# EAGLE design slave (EAGLE 5.11)
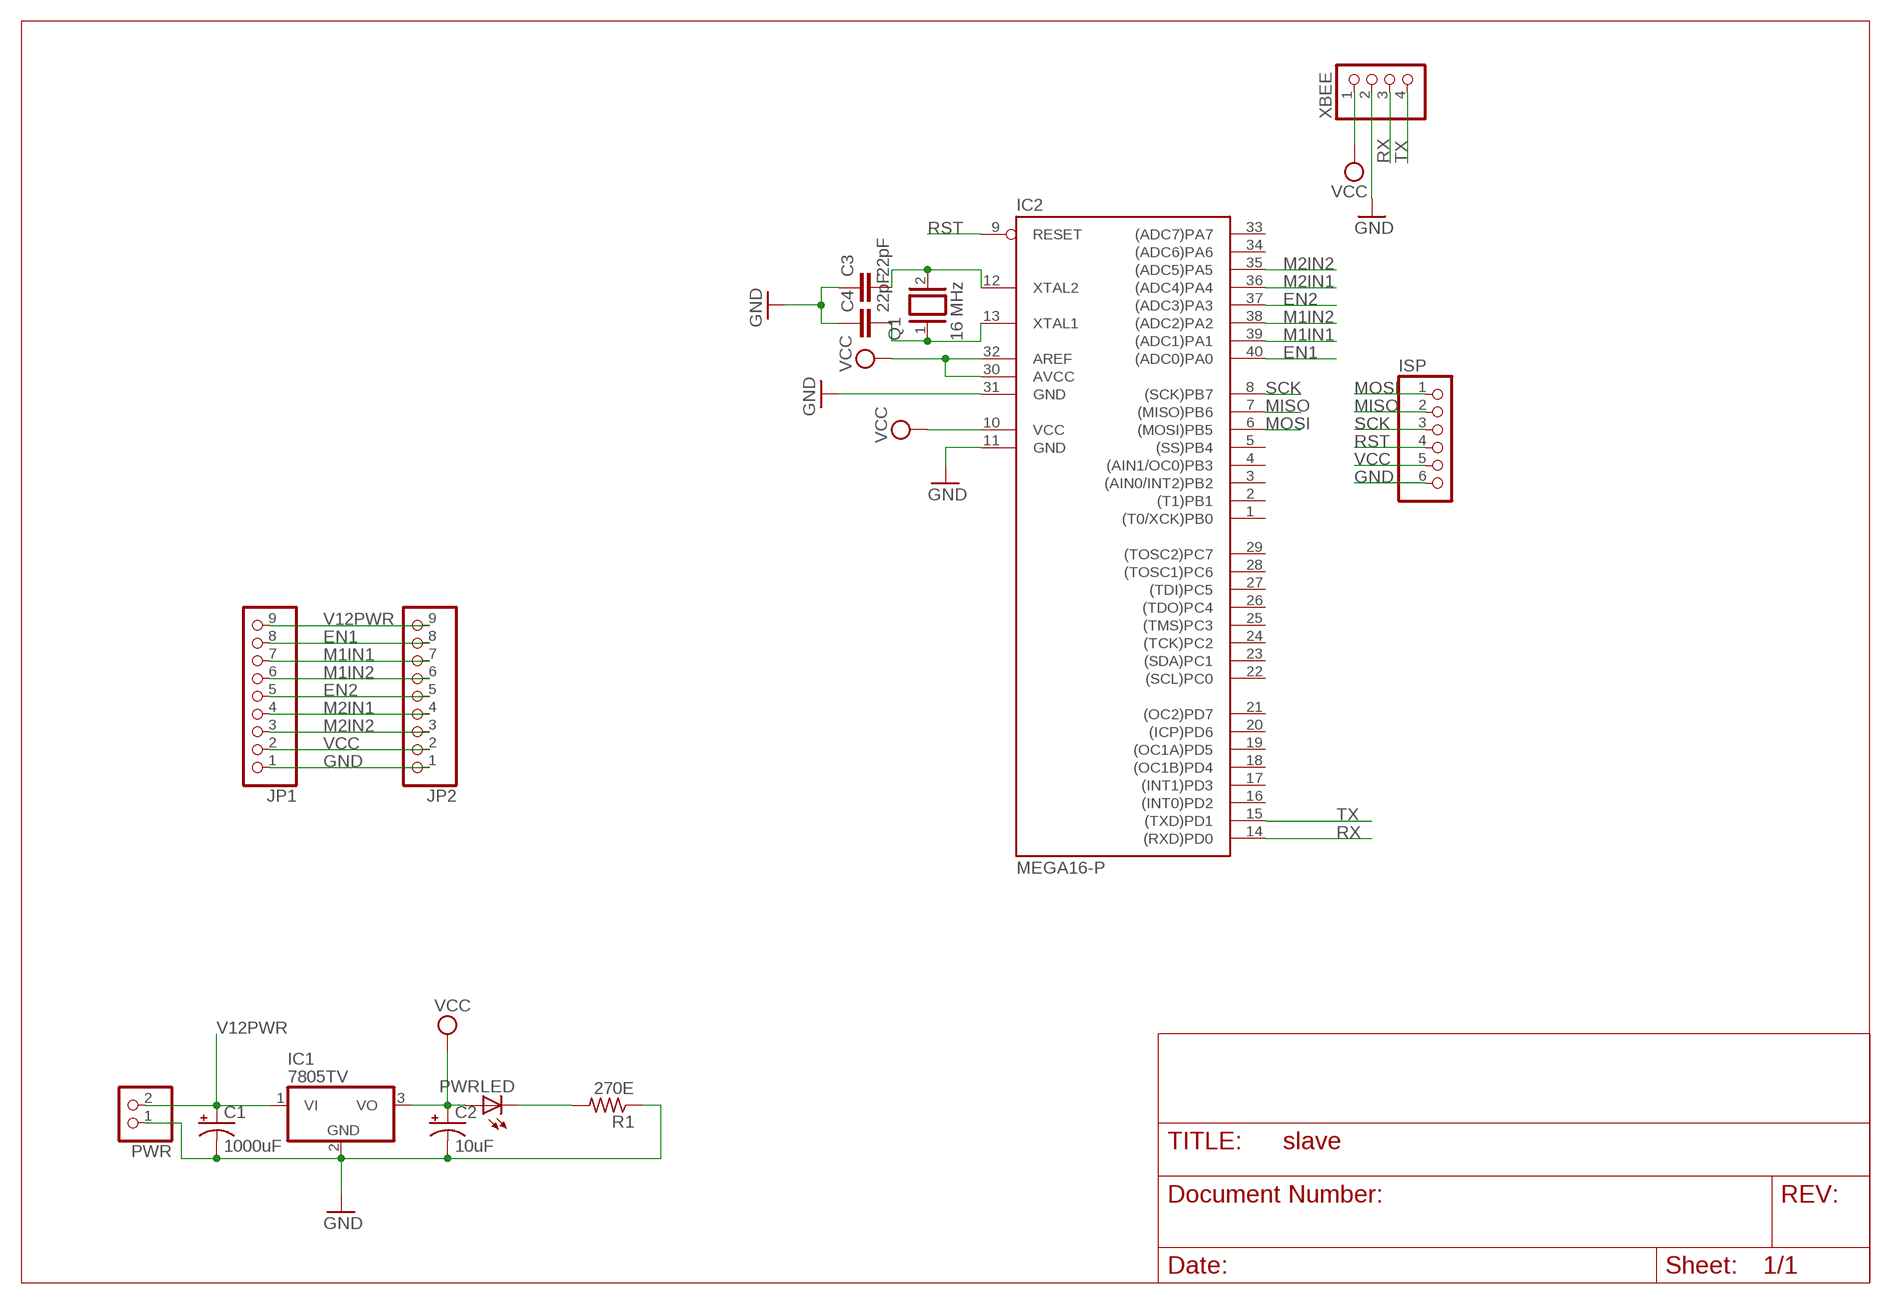
[diagram p0: schematic, sheet 1]

## Parts
C1  1000uF  CPOL-USE3.5-8  [E3,5-8]
C2  10uF  CPOL-USE2.5-6  [E2,5-6]
C3  22pF  C2,5-3  [C2.5-3]
C4  22pF  C2,5-3  [C2.5-3]
IC1  7805TV  [TO220V]
IC2  MEGA16-P  [DIL40]
ISP  PINHD-1X6  [1X06]
JP1  PINHD-1X9  [1X09]
JP2  PINHD-1X9  [1X09]
PWR  PINHD-1X2  [1X02]
PWRLED  LED5MM  [LED5MM]
Q1  16 MHz  XTAL/S  [QS]
R1  270E  R-US_0207/7  [0207/7]
XBEE  PINHD-1X4  [1X04]

## Nets
EN1: IC2.40((ADC0)PA0) JP1.8 JP2.8
EN2: IC2.37((ADC3)PA3) JP1.5 JP2.5
GND: C1.- C2.- C3.1 C4.1 IC1.2(GND) IC2.11(GND) IC2.31(GND) ISP.6 JP1.1 JP2.1 PWR.1 R1.1 XBEE.2
M1IN1: IC2.39((ADC1)PA1) JP1.7 JP2.7
M1IN2: IC2.38((ADC2)PA2) JP1.6 JP2.6
M2IN1: IC2.36((ADC4)PA4) JP1.4 JP2.4
M2IN2: IC2.35((ADC5)PA5) JP1.3 JP2.3
MISO: IC2.7((MISO)PB6) ISP.2
MOSI: IC2.6((MOSI)PB5) ISP.1
N$2: C3.2 IC2.12(XTAL2) Q1.2
N$3: PWRLED.K(C) R1.2
N$4: C4.2 IC2.13(XTAL1) Q1.1
RST: IC2.9(RESET) ISP.4
RX: IC2.14((RXD)PD0) XBEE.3
SCK: IC2.8((SCK)PB7) ISP.3
TX: IC2.15((TXD)PD1) XBEE.4
V12PWR: C1.+ IC1.1(VI) JP1.9 JP2.9 PWR.2
VCC: C2.+ IC1.3(VO) IC2.10(VCC) IC2.30(AVCC) IC2.32(AREF) ISP.5 JP1.2 JP2.2 PWRLED.A XBEE.1
Unconnected: IC2.1((T0/XCK)PB0) IC2.2((T1)PB1) IC2.3((AIN0/INT2)PB2) IC2.4((AIN1/OC0)PB3) IC2.5((SS)PB4) IC2.16((INT0)PD2) IC2.17((INT1)PD3) IC2.18((OC1B)PD4) IC2.19((OC1A)PD5) IC2.20((ICP)PD6) IC2.21((OC2)PD7) IC2.22((SCL)PC0) IC2.23((SDA)PC1) IC2.24((TCK)PC2) IC2.25((TMS)PC3) IC2.26((TDO)PC4) IC2.27((TDI)PC5) IC2.28((TOSC1)PC6) IC2.29((TOSC2)PC7) IC2.33((ADC7)PA7) IC2.34((ADC6)PA6)

## Library data of the parts
C1 C2 = resistor:CPOL-US: POLARIZED CAPACITOR, American symbol
C3 C4 = capacitor-wima:C: CAPACITOR naming: grid - package width
IC1 = linear:78*: Positive VOLTAGE REGULATOR Source: http://cache.national.com/ds/LM/LM78L05.pdf http://www.fairchildsemi.com/ds/LM/LM7805.pdf
IC2 = atmel:MEGA16-P: MICROCONTROLLER 16 Kbytes FLASH 1 kbytes SRAM 512 bytes EEPROM USART 8-channel 10 bit ADC Source: avr.lbr; MPN: ATMEGA16-16PU; OC_FARNELL: 9171142; OC_NEWARK: 01M6885
ISP = pinhead:PINHD-1X6: PIN HEADER
JP1 JP2 = pinhead:PINHD-1X9: PIN HEADER
PWR = pinhead:PINHD-1X2: PIN HEADER
PWRLED = led:LED: LED OSRAM: - CHIPLED LG R971, LG N971, LY N971, LG Q971, LY Q971, LO R971, LY R971 LH N974, LH R974 LS Q976, LO Q976, LY Q976 LO Q996 - Hyper CHIPLED LW Q18S LB Q993, LB Q99A, LB R99A - SideLED LS A670, LO A670, LY A670, LG A670, LP A670 LB A673, LV A673, LT A673, LW A673 LH A674 LY A675 LS A676, LA A676, LO A676, LY A676, LW A676 LS A679, LY A679, LG A679 - Hyper Micro SIDELED® LS Y876, LA Y876, LO Y876, LY Y876 LT Y87S - SmartLED LW L88C, LW L88S LB L89C, LB L89S, LG L890 LS L89K, LO L89K, LY L89K LS L896, LA L896, LO L896, LY L896 - TOPLED LS T670, LO T670, LY T670, LG T670, LP T670 LSG T670, LSP T670, LSY T670, LOP T670, LYG T670 LG T671, LOG T671, LSG T671 LB T673, LV T673, LT T673, LW T673 LH T674 LS T676, LA T676, LO T676, LY T676, LB T676, LH T676, LSB T676, LW T676 LB T67C, LV T67C, LT T67C, LS T67K, LO T67K, LY T67K, LW E67C LS E67B, LA E67B, LO E67B, LY E67B, LB E67C, LV E67C, LT E67C LW T67C LS T679, LY T679, LG T679 LS T770, LO T770, LY T770, LG T770, LP T770 LB T773, LV T773, LT T773, LW T773 LH T774 LS E675, LA E675, LY E675, LS T675 LS T776, LA T776, LO T776, LY T776, LB T776 LHGB T686 LT T68C, LB T68C - Hyper Mini TOPLED® LB M676 - Mini TOPLED Santana® LG M470 LS M47K, LO M47K, LY M47K Source: http://www.osram.convergy.de LUXEON: - LUMILED® LXK2-PW12-R00, LXK2-PW12-S00, LXK2-PW14-U00, LXK2-PW14-V00 LXK2-PM12-R00, LXK2-PM12-S00, LXK2-PM14-U00 LXK2-PE12-Q00, LXK2-PE12-R00, LXK2-PE12-S00, LXK2-PE14-T00, LXK2-PE14-U00 LXK2-PB12-K00, LXK2-PB12-L00, LXK2-PB12-M00, LXK2-PB14-N00, LXK2-PB14-P00, LXK2-PB14-Q00 LXK2-PR12-L00, LXK2-PR12-M00, LXK2-PR14-Q00, LXK2-PR14-R00 LXK2-PD12-Q00, LXK2-PD12-R00, LXK2-PD12-S00 LXK2-PH12-R00, LXK2-PH12-S00 LXK2-PL12-P00, LXK2-PL12-Q00, LXK2-PL12-R00 Source: www.luxeon.com KINGBRIGHT: KA-3528ASYC Source: www.kingbright.com
Q1 = special:XTAL/S: CRYSTAL
R1 = resistor:R-US_: RESISTOR, American symbol
XBEE = pinhead:PINHD-1X4: PIN HEADER

## Board
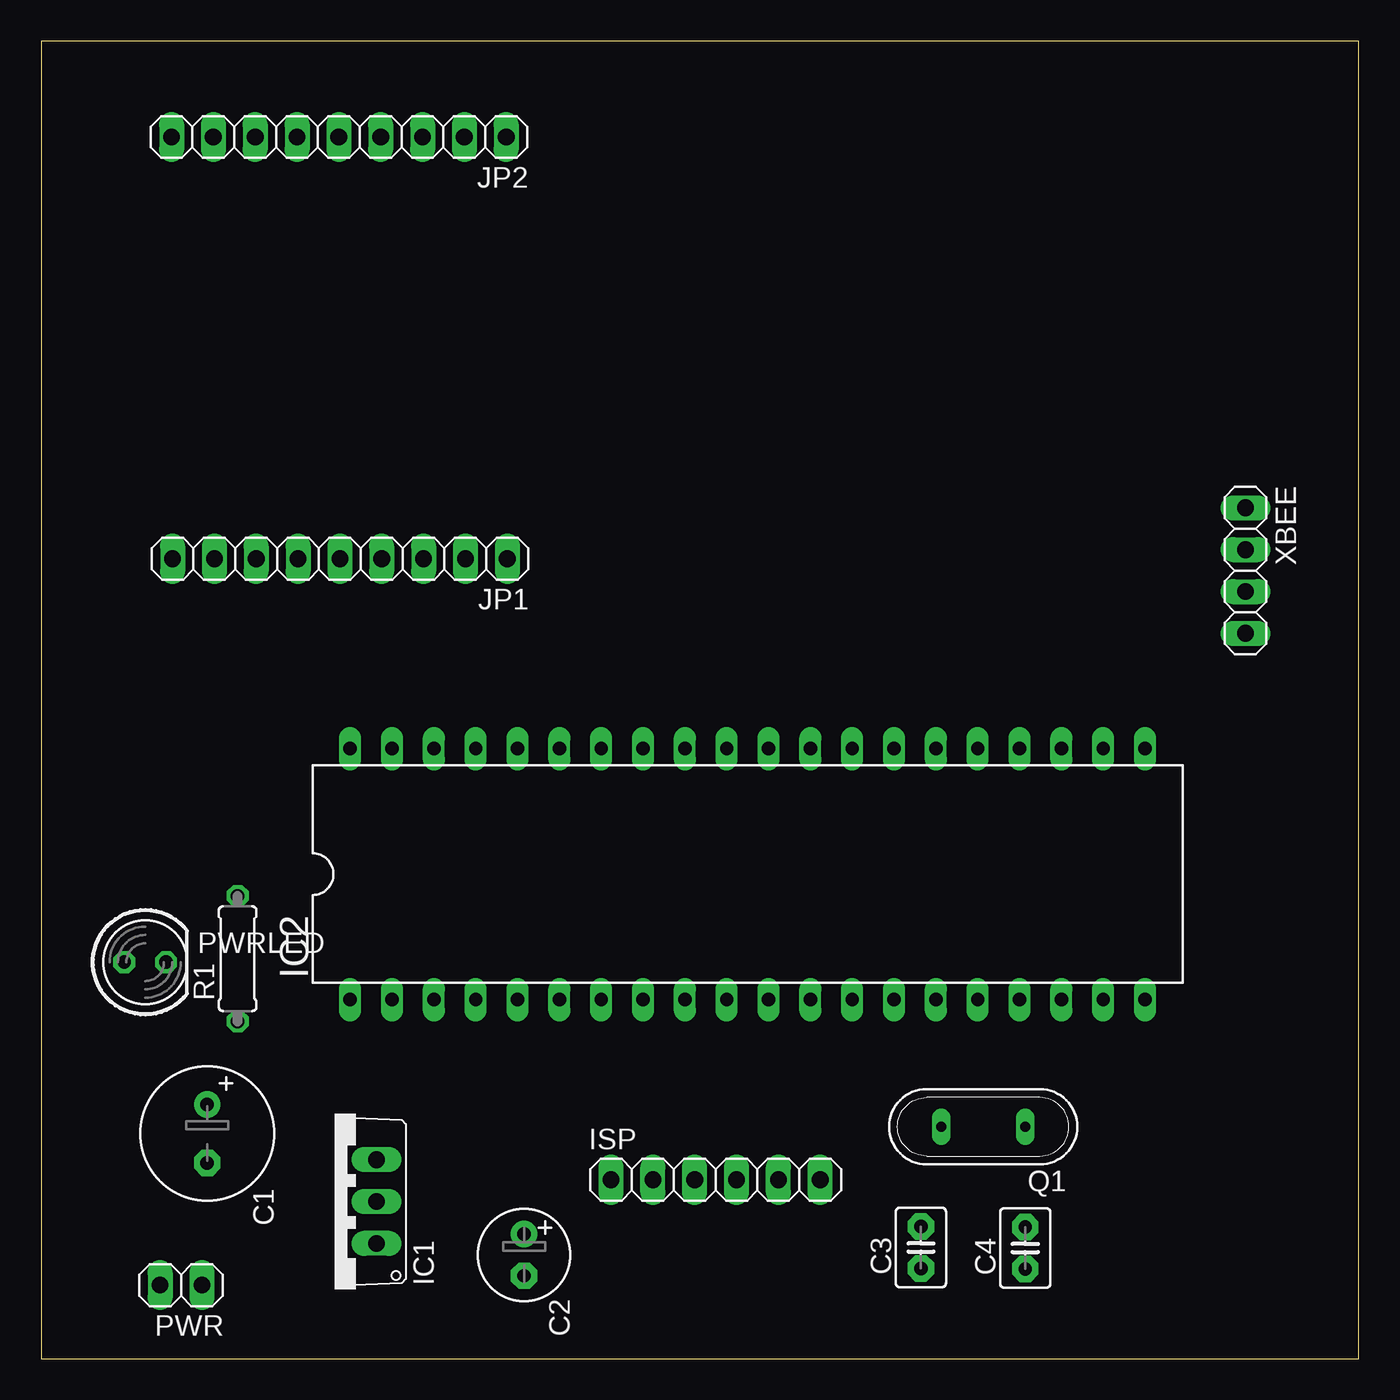
[diagram p1: board, top side]
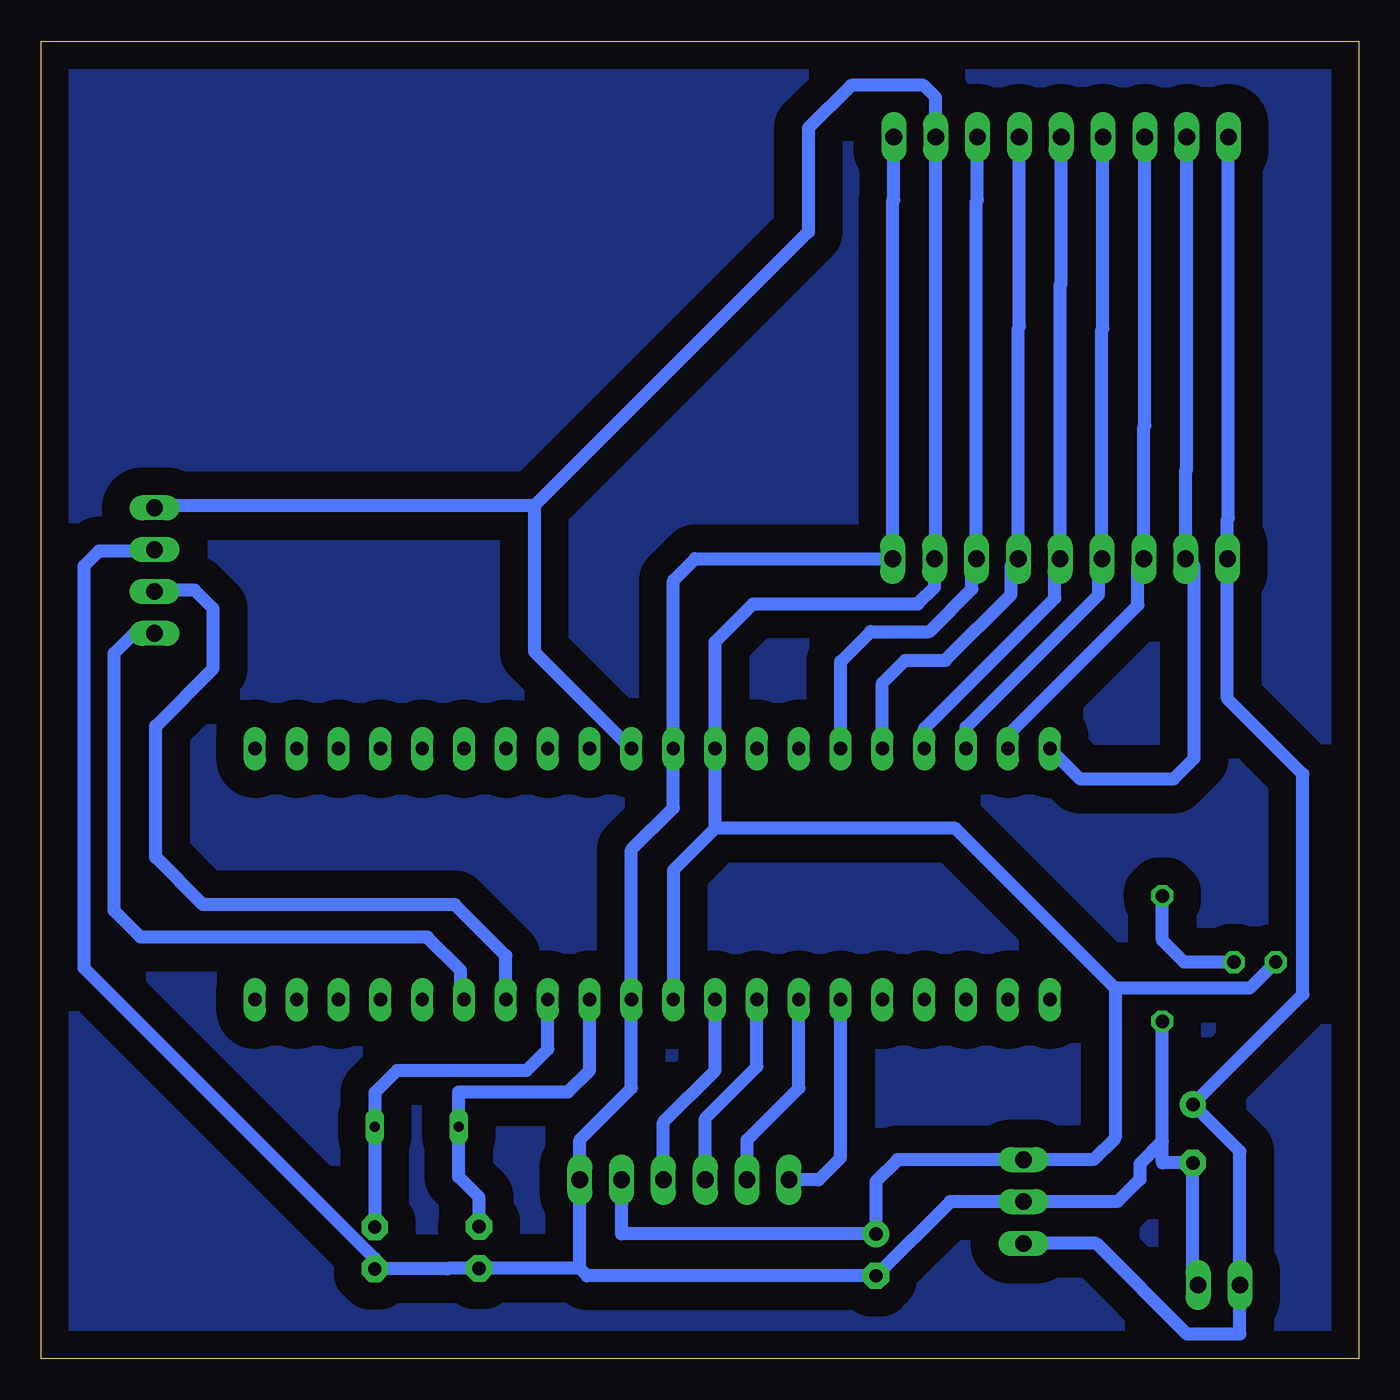
[diagram p2: board, bottom side, seen from below]

Size 80 x 80 mm. Coordinates in mm from the lower left corner, seen from the top.
Outline: 0,0 80,0 80,80 0,80 0,0
Copper layers (1*16): Top 0.035mm / dielectric 1.5mm / Bottom 0.035mm
Design rules "default *": minimum track width 0.8mm, minimum drill 24mil, track to track 0.5mm, track to pad 8mil, pad to pad 8mil, via to via 8mil, smd to smd 8mil, copper to edge 40mil, drill to drill 1mm, minimum pad ring 10mil, minimum via ring 8mil, stop-mask expansion 4mil, vias tented up to drill 0mil, thermal gap 10mil

### Footprints (pad centres in the part's own frame; a part is rotated, then mirrored left to right if it is on the bottom)
E3,5-8 = drill 0.813 pad 1.6 round: + -1.778,0 | drill 0.813 pad 1.6 octagon: - 1.778,0
E2,5-6 = drill 0.813 pad 1.6 round: + -1.27,0 | drill 0.813 pad 1.6 octagon: - 1.27,0
C2.5-3 = drill 0.813 pad 1.6 octagon: 1 -1.27,0; 2 1.27,0
TO220V = drill 1.016 long: 1 -2.54,-2.54; 2 0,-2.54; 3 2.54,-2.54
DIL40 = drill 0.813 long: 1 -24.13,-7.62; 2 -21.59,-7.62; 3 -19.05,-7.62; 4 -16.51,-7.62; 5 -13.97,-7.62; 6 -11.43,-7.62; 7 -8.89,-7.62; 8 -6.35,-7.62; 9 -3.81,-7.62; 10 -1.27,-7.62; 11 1.27,-7.62; 12 3.81,-7.62; 13 6.35,-7.62; 14 8.89,-7.62; 15 11.43,-7.62; 16 13.97,-7.62; 17 16.51,-7.62; 18 19.05,-7.62; 19 21.59,-7.62; 20 24.13,-7.62; 21 24.13,7.62; 22 21.59,7.62; 23 19.05,7.62; 24 16.51,7.62; 25 13.97,7.62; 26 11.43,7.62; 27 8.89,7.62; 28 6.35,7.62; 29 3.81,7.62; 30 1.27,7.62; 31 -1.27,7.62; 32 -3.81,7.62; 33 -6.35,7.62; 34 -8.89,7.62; 35 -11.43,7.62; 36 -13.97,7.62; 37 -16.51,7.62; 38 -19.05,7.62; 39 -21.59,7.62; 40 -24.13,7.62
1X06 = drill 1.016 long: 1 -6.35,0; 2 -3.81,0; 3 -1.27,0; 4 1.27,0; 5 3.81,0; 6 6.35,0
1X09 = drill 1.016 long: 1 -10.16,0; 2 -7.62,0; 3 -5.08,0; 4 -2.54,0; 5 0,0; 6 2.54,0; 7 5.08,0; 8 7.62,0; 9 10.16,0
1X02 = drill 1.016 long: 1 -1.27,0; 2 1.27,0
LED5MM = drill 0.813 octagon: A -1.27,0; K 1.27,0
QS = drill 0.61 long: 1 -2.54,0; 2 2.54,0
0207/7 = drill 0.813 octagon: 1 -3.81,0; 2 3.81,0
1X04 = drill 1.016 long: 1 -3.81,0; 2 -1.27,0; 3 1.27,0; 4 3.81,0

### Placement (x,y rotation side)
C1  10.08,13.67 270 top
C2  29.32,6.31 270 top
C3  53.41,6.76 90 top
C4  59.75,6.73 90 top
IC1  17.82,9.55 90 top
IC2  42.89,29.43 0 top
ISP  40.95,10.87 0 top
JP1  18.14,48.58 180 top
JP2  18.07,74.18 180 top
PWR  8.49,4.48 180 top
PWRLED  6.31,24.08 0 top
Q1  57.19,14.09 180 top
R1  11.93,24.29 90 top
XBEE  73.11,47.86 270 top

### Tracks (layer width: path | path; a pad name or v marks a point on that pad's centre or on a via)
EN1
  Bottom 0.8: JP2.8 10.45,53.97 10.52,53.9 JP1.8 10.43,48.58 10,48.14 10,36.45 11.26,35.2 16.91,35.2 IC2.40
EN2
  Bottom 0.8: JP2.5 18.07,65.27 18.14,65.2 JP1.5 18.46,48.26 18.46,46.18 26.38,38.26 IC2.37
GND
  Bottom 0.8: 47.3,5.49 46.85,5.04 C2.- 24.81,9.55 IC1.2 14.65,9.55 13.3,10.9 13.3,11.82 11.93,13.2 | 47.3,5.49 C3.1 55.3,5.49 55.33,5.46 C4.1 59.75,6.08 77.39,23.72 77.39,48.14 76.48,49.05 73.19,49.05 XBEE.2 | 47.3,5.49 ISP.6 47.3,13.3 44.16,16.44 IC2.11 44.16,30.9 41.62,33.44 IC2.31 41.62,47.25 40.3,48.58 JP1.1 28.3,70.3 28.23,70.36 JP2.1 | PWR.1 10.08,4.47 C1.- 11.93,11.89 11.93,13.2 | 11.93,13.2 R1.1
M1IN1
  Bottom 0.8: JP2.7 12.99,56.66 13.06,56.6 JP1.7 13.42,48.21 13.42,45.76 21.32,37.86 21.32,36.53 21.3,36.55 IC2.39
M1IN2
  Bottom 0.8: JP2.6 15.53,62.56 15.6,62.5 JP1.6 15.8,48.37 15.8,46.39 23.84,38.35 IC2.38
M2IN1
  Bottom 0.8: JP2.4 20.61,62.66 20.68,62.6 JP1.4 21.11,48.14 21.11,46.39 25.1,42.4 27.54,42.4 28.92,41.03 IC2.36
M2IN2
  Bottom 0.8: JP2.3 23.15,70.36 23.22,70.3 JP1.3 23.49,48.3 23.49,46.74 26.08,44.15 29.64,44.15 31.46,42.33 IC2.35
MISO
  Bottom 0.8: ISP.2 37.14,13.3 34,16.44 IC2.7
MOSI
  Bottom 0.8: ISP.1 32.8,10.87 31.46,12.21 IC2.6
N$1
  pour Bottom (isolate 1.676): 0.98,79.14 1.12,79.28 79.14,79.28 79.14,0.56 78.86,0.28 0.98,0.28 0.98,78.86
N$2
  Bottom 0.8: IC2.12 46.7,17.5 48,16.2 54.65,16.2 Q1.2 54.65,11.04 53.41,9.8 C3.2
N$3
  Bottom 0.8: PWRLED.K 10.6,24.08 11.93,25.41 R1.2
N$4
  Bottom 0.8: IC2.13 49.24,18.8 50.54,17.5 58.4,17.5 59.73,16.17 Q1.1 59.75,14.09 C4.2
RST
  Bottom 0.8: ISP.4 42.22,14.36 39.08,17.5 IC2.9
RX
  Bottom 0.8: XBEE.3 73.03,46.67 70.68,46.67 69.56,45.55 69.56,41.91 73.05,38.42 73.05,30.44 70.19,27.57 54.88,27.57 51.78,24.47 IC2.14
SCK
  Bottom 0.8: ISP.3 39.68,14.6 36.54,17.74 IC2.8
TX
  Bottom 0.8: IC2.15 54.53,22.01 54.53,23.58 56.56,25.61 73.96,25.61 75.57,27.22 75.57,42.82 74.35,44.05 XBEE.4
V12PWR
  Bottom 0.8: IC1.1 15.95,7.01 10.44,1.5 7.22,1.5 PWR.2 7.22,12.59 C1.+ 3.4,22.13 3.4,35.5 7.98,40.08 JP1.9 7.98,51 7.91,51.06 JP2.9
VCC
  Bottom 0.8: 39.08,32.2 24.5,32.2 14.8,22.5 | ISP.5 44.76,7.58 C2.+ 29.32,10.77 28,12.09 IC1.3 16.11,12.09 14.8,13.4 14.8,22.5 | 39.08,32.2 41.62,29.66 IC2.10 | 14.8,22.5 6.62,22.5 PWRLED.A | 39.08,32.2 IC2.32 39.08,43.52 36.77,45.83 26.77,45.83 25.76,46.85 JP1.2 25.69,48.58 JP2.2 25.69,76.59 26.43,77.32 30.83,77.32 33.42,74.73 33.42,68.42 50.05,51.78 | XBEE.1 73,51.78 50.05,51.78 | IC2.30 50.05,42.94 50.05,51.78